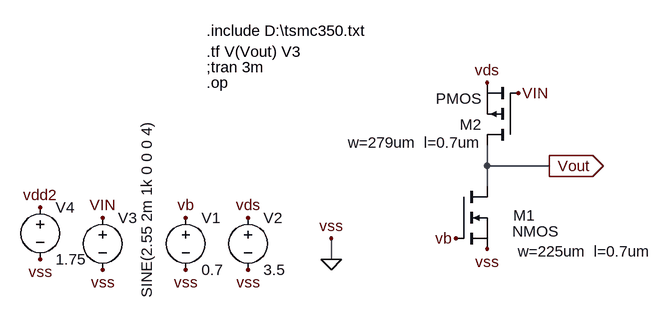
[diagram p0: schematic 20ELB270.asc]
20ELB270.asc, the LTspice schematic file:
Version 4
SHEET 1 880 680
WIRE 304 96 304 64
WIRE 400 96 304 96
WIRE 304 128 304 96
WIRE 64 240 64 208
FLAG 304 224 vss
FLAG -64 256 vss
FLAG -160 256 vss
FLAG 64 240 0
FLAG 64 208 vss
FLAG -160 176 vb
FLAG 256 208 vb
FLAG -64 176 vds
FLAG -288 256 vss
FLAG -288 176 VIN
FLAG 352 -16 VIN
FLAG 304 -32 vds
FLAG -384 240 vss
FLAG -384 160 vdd2
FLAG 400 96 Vout
IOPIN 400 96 Out
SYMBOL nmos 256 128 R0
WINDOW 123 95 100 Left 2
WINDOW 0 88 44 Left 2
WINDOW 3 87 69 Left 2
SYMATTR Value2 w=225um  l=0.7um
SYMATTR InstName M1
SYMBOL voltage -160 160 R0
SYMATTR InstName V1
SYMATTR Value 0.7
SYMBOL voltage -64 160 R0
SYMATTR InstName V2
SYMATTR Value 3.5
SYMBOL pmos 352 64 R180
WINDOW 123 56 4 Left 2
SYMATTR Value2 w=279um  l=0.7um
SYMATTR InstName M2
SYMBOL voltage -288 160 R0
WINDOW 3 68 -133 VRight 2
WINDOW 123 0 0 Left 0
WINDOW 39 0 0 Left 0
SYMATTR Value SINE(2.55 2m 1k 0 0 0 4)
SYMATTR InstName V3
SYMBOL voltage -384 144 R0
SYMATTR InstName V4
SYMATTR Value 1.75
TEXT -128 -112 Left 2 !.include D:\\tsmc350.txt
TEXT -128 -32 Left 2 !.op
TEXT -128 -56 Left 2 !;tran 3m
TEXT -128 -80 Left 2 !.tf V(Vout) V3

The netlist it stands for:
* 20ELB270.asc
M1 Vout vb 0 0 NMOS w=225um  l=0.7um
V1 vb 0 0.7
V2 vds 0 3.5
M2 Vout VIN vds vds PMOS w=279um  l=0.7um
V3 VIN 0 SINE(2.55 2m 1k 0 0 0 4)
V4 vdd2 0 1.75
.model NMOS NMOS
.model PMOS PMOS
.lib standard.mos
.include D:\tsmc350.txt
.op
;tran 3m
.tf V(Vout) V3
.backanno
.end